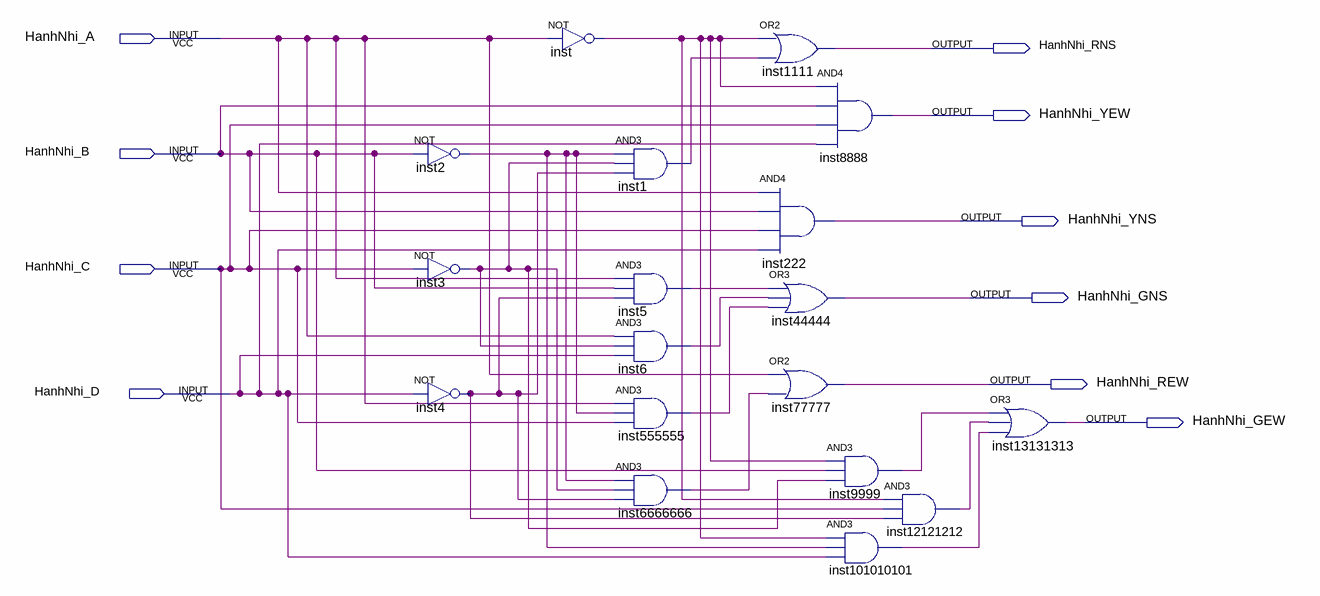
[diagram p0: schematic sheet]
// Quartus schematic Assignment4.bdf as structural Verilog: 18 symbols, 10 pins
module Assignment4 (
  input  HanhNhi_A,
  input  HanhNhi_B,
  input  HanhNhi_C,
  input  HanhNhi_D,
  output HanhNhi_RNS,
  output HanhNhi_YEW,
  output HanhNhi_YNS,
  output HanhNhi_GNS,
  output HanhNhi_REW,
  output HanhNhi_GEW
);

  wire inst1_out, inst2_out, inst3_out, inst4_out, inst5_out, inst6_out, inst9999_out, inst555555_out,
       inst6666666_out, inst12121212_out, inst101010101_out, inst_out;

  not inst2 (inst2_out, HanhNhi_B);
  not inst3 (inst3_out, HanhNhi_C);
  not inst4 (inst4_out, HanhNhi_D);
  not inst (inst_out, HanhNhi_A);
  and inst1 (inst1_out, inst2_out, inst3_out, inst4_out);
  and inst5 (inst5_out, HanhNhi_A, HanhNhi_B, inst4_out);
  and inst6 (inst6_out, HanhNhi_A, inst3_out, HanhNhi_D);
  and inst555555 (inst555555_out, HanhNhi_A, inst2_out, HanhNhi_C);
  and inst6666666 (inst6666666_out, inst2_out, inst3_out, inst4_out);
  or inst1111 (HanhNhi_RNS, inst_out, inst1_out);
  and inst222 (HanhNhi_YNS, HanhNhi_A, HanhNhi_B, HanhNhi_C, HanhNhi_D);
  or inst44444 (HanhNhi_GNS, inst5_out, inst6_out, inst555555_out);
  or inst77777 (HanhNhi_REW, HanhNhi_A, inst6666666_out);
  and inst8888 (HanhNhi_YEW, inst_out, HanhNhi_B, HanhNhi_C, HanhNhi_D);
  and inst9999 (inst9999_out, inst_out, HanhNhi_B, inst3_out);
  and inst101010101 (inst101010101_out, inst_out, inst2_out, HanhNhi_D);
  and inst12121212 (inst12121212_out, inst_out, HanhNhi_C, inst4_out);
  or inst13131313 (HanhNhi_GEW, inst9999_out, inst12121212_out, inst101010101_out);
endmodule
